# Altium schematic sheet Thermistors.SchDoc
size A4; SheetNumber: 4; SheetTotal: 9
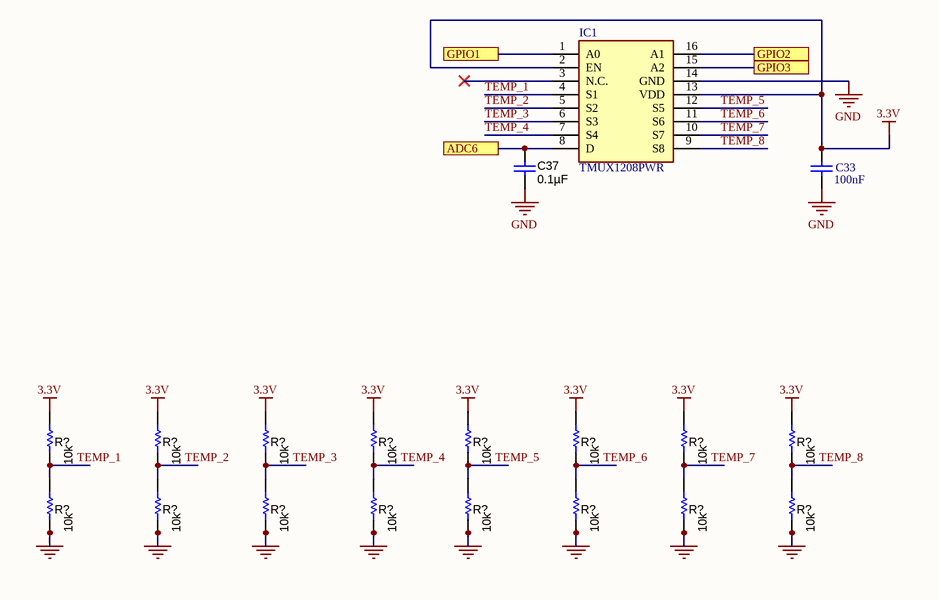
[diagram p0: Thermistors.SchDoc]

## Parts
(Parts that share a designator on the sheet are numbered #1, #2 ... from top to bottom, then left to right.)
C33  value 100nF  [C0805]  (hidden comment: 10V)
C37  ValueDisplayed: 0.1µF  [0603L]  (hidden comment: 0603YC104JAT2A)
IC1  TMUX1208PWR  [SOP65P640X120-16N]
R?#1  ValueDisplayed: 10k  [2512L]  (hidden comment: CRE2512-FZ-R007E-3)
R?#2  ValueDisplayed: 10k  [2512L]  (hidden comment: CRE2512-FZ-R007E-3)
R?#3  ValueDisplayed: 10k  [2512L]  (hidden comment: CRE2512-FZ-R007E-3)
R?#4  ValueDisplayed: 10k  [2512L]  (hidden comment: CRE2512-FZ-R007E-3)
R?#5  ValueDisplayed: 10k  [2512L]  (hidden comment: CRE2512-FZ-R007E-3)
R?#6  ValueDisplayed: 10k  [2512L]  (hidden comment: CRE2512-FZ-R007E-3)
R?#7  ValueDisplayed: 10k  [2512L]  (hidden comment: CRE2512-FZ-R007E-3)
R?#8  ValueDisplayed: 10k  [2512L]  (hidden comment: CRE2512-FZ-R007E-3)
R?#9  ValueDisplayed: 10k  [2512L]  (hidden comment: CRE2512-FZ-R007E-3)
R?#10  ValueDisplayed: 10k  [2512L]  (hidden comment: CRE2512-FZ-R007E-3)
R?#11  ValueDisplayed: 10k  [2512L]  (hidden comment: CRE2512-FZ-R007E-3)
R?#12  ValueDisplayed: 10k  [2512L]  (hidden comment: CRE2512-FZ-R007E-3)
R?#13  ValueDisplayed: 10k  [2512L]  (hidden comment: CRE2512-FZ-R007E-3)
R?#14  ValueDisplayed: 10k  [2512L]  (hidden comment: CRE2512-FZ-R007E-3)
R?#15  ValueDisplayed: 10k  [2512L]  (hidden comment: CRE2512-FZ-R007E-3)
R?#16  ValueDisplayed: 10k  [2512L]  (hidden comment: CRE2512-FZ-R007E-3)

## Ports
ADC6, GPIO1, GPIO2, GPIO3

## Nets
3.3V: C33.1 IC1.2(EN) IC1.13(VDD) R?#1.1 R?#2.1 R?#3.1 R?#4.1 R?#5.1 R?#6.1 R?#7.1 R?#8.1
GND: C33.2 C37.1 IC1.14(GND)
NetR?#9_2: R?#9.2 R?#10.2 R?#11.2 R?#12.2 R?#13.2 R?#14.2 R?#15.2 R?#16.2
ADC6: C37.2 IC1.8(D) ; port ADC6
GPIO1: IC1.1(A0) ; port GPIO1
GPIO2: IC1.16(A1) ; port GPIO2
GPIO3: IC1.15(A2) ; port GPIO3
TEMP_1: IC1.4(S1) R?#1.2 R?#9.1
TEMP_2: IC1.5(S2) R?#2.2 R?#10.1
TEMP_3: IC1.6(S3) R?#3.2 R?#11.1
TEMP_4: IC1.7(S4) R?#4.2 R?#12.1
TEMP_5: IC1.12(S5) R?#5.2 R?#13.1
TEMP_6: IC1.11(S6) R?#6.2 R?#14.1
TEMP_7: IC1.10(S7) R?#7.2 R?#15.1
TEMP_8: IC1.9(S8) R?#8.2 R?#16.1

Not connected (* = marked no-connect by the designer): IC1 3(N.C.)*

## Notes on the sheet
- Title:
- Size:
- Date:
- A4
- Author:
- Revision:
- Sheet
- of
- File:

## Library data of the parts
C33 = Cap: C0805C104K8RACTU. 0.1µF ±10% 10V Ceramic Capacitor X7R 0805 (2012 Metric) /; Published: 8-Jun-2000; LatestRevisionDate: 17-Jul-2002; LatestRevisionNote: Re-released for DXP Platform.; PackageReference: RAD-0.3; Publisher: Altium Limited; PackageDescription: Radial Cap, Thru-Hole; 2 Leads; 0.3 in Pin Spacing
C37 = 0603YC104JAT2A: CAP, CERM, 0.1 µF, 16 V, +/- 5%, X7R, 0603; Manufacturer: AVX; Polarized: N; CompType: Capacitor; Value: 0.1uF; U/M: EA; Cap_F: 0.0000001; Tolerance_%: 5; ESR_ohm: 0.039; Value1: 0.039 ohm; VDC_V: 16; Value2: 16V; TaMin_C: -55; TaMax_C: 125; Cap_Case: 0603; AEC Category: Q200; SymbolVersion: 2008-07-09; PartNumber: 0603YC104JAT2A; PackageReference: 0603; RoHS: Y; MountType: SMT; Technology: Ceramic; TempCo: X7R; Published: 2008-06-19; Publisher: Texas Instruments; LatestRevisionDate: 2016-03-19; ComponentLink1Description: Datasheet link; ComponentLink1URL: http://datasheets.avx.com/X7RDielectric.pdf; Supplier 1: Digi-Key; Supplier Part Number 1: 478-3726-1-ND; Supplier 2: Mouser; Supplier Part Number 2: 581-0603YC104J; Supplier 3: Farnell; Supplier Part Number 3: 1740612; AEC Qualified: N; AEC Grade: N/A
IC1 = TMUX1208PWR: Integrated Circuit; Manufacturer_Name: Texas Instruments; Datasheet Link: http://www.ti.com/lit/gpn/tmux1208; Height: 1.2mm; Manufacturer_Part_Number: TMUX1208PWR; Mouser Part Number: 595-TMUX1208PWR; Mouser Price/Stock: https://www.mouser.co.uk/ProductDetail/Texas-Instruments/TMUX1208PWR/?qs=lc2O%252BfHJPVbYdIGs2%2FdugA%3D%3D; Arrow Part Number: TMUX1208PWR; Arrow Price/Stock: https://www.arrow.com/en/products/tmux1208pwr/texas-instruments
R?#1-R?#16 = PMR100HZPFU7L00: RES SMD 0.007 OHM 1% 3W 2512; Manufacturer: Bourns Inc.; CompType: Resistor; Value: 0.007; Value_Code: 7L000; Tolerance_%: 1; Power_W: 3; TempCo: 100 ppm/C; EIA_Code: E96; U/M: EA; SymbolVersion: 2009-05-29; PartNumber: CRE2512-FZ-R007E-3; PackageReference: 2512; RoHS: Y; Res_ohm: 0.007; Value1: 1%; Value2: 3W; MountType: SMT; Technology: Thick Film; Published: 2008-06-26; Publisher: Texas Instruments; LatestRevisionDate: 2014-12-15; ComponentLink1Description: Datasheet link; ComponentLink1URL: http://media.digikey.com/pdf/Data%20Sheets/Rohm%20PDFs/PMR100-SERIES.pdf; Supplier 1: Digi-Key; Supplier Part Number 1: CRE2512-FZ-R007E-3CT-ND